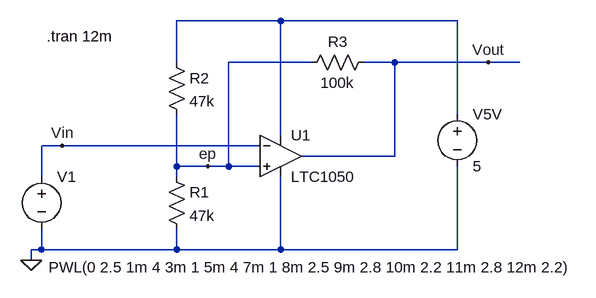
[diagram p0: schematic schmitt_5V.asc]
schmitt_5V.asc, the LTspice schematic file:
Version 4
SHEET 1 880 680
WIRE 224 -16 64 -16
WIRE 496 -16 224 -16
WIRE 64 48 64 -16
WIRE 272 48 144 48
WIRE 400 48 352 48
WIRE 544 48 400 48
WIRE 592 48 544 48
WIRE 496 128 496 -16
WIRE 224 160 224 -16
WIRE -112 176 -144 176
WIRE 192 176 -112 176
WIRE 400 192 400 48
WIRE 400 192 256 192
WIRE 64 208 64 128
WIRE 112 208 64 208
WIRE 144 208 144 48
WIRE 144 208 112 208
WIRE 192 208 144 208
WIRE -144 224 -144 176
WIRE 64 224 64 208
WIRE -144 336 -144 304
WIRE -144 336 -160 336
WIRE 64 336 64 304
WIRE 64 336 -144 336
WIRE 224 336 224 224
WIRE 224 336 64 336
WIRE 496 336 496 208
WIRE 496 336 224 336
WIRE -160 352 -160 336
FLAG 544 48 Vout
FLAG 112 208 ep
FLAG -112 176 Vin
FLAG -160 352 0
SYMBOL Opamps\\LTC1050 224 128 R0
SYMATTR InstName U1
SYMBOL res 368 32 R90
WINDOW 0 0 56 VBottom 2
WINDOW 3 32 56 VTop 2
SYMATTR InstName R3
SYMATTR Value 100k
SYMBOL voltage 496 112 R0
SYMATTR InstName V5V
SYMATTR Value 5
SYMBOL voltage -144 208 R0
WINDOW 123 0 0 Left 2
WINDOW 39 0 0 Left 2
WINDOW 3 11 155 Left 2
SYMATTR Value PWL(0 2.5 1m 4 3m 1 5m 4 7m 1 8m 2.5 9m 2.8 10m 2.2 11m 2.8 12m 2.2)
SYMATTR InstName V1
SYMBOL res 48 208 R0
SYMATTR InstName R1
SYMATTR Value 47k
SYMBOL res 48 32 R0
SYMATTR InstName R2
SYMATTR Value 47k
TEXT -136 8 Left 2 !.tran 12m

The netlist it stands for:
* schmitt_5V.asc
XU1 ep Vin N001 0 Vout LTC1050  ; pins In+ In- V+ V- OUT
R3 Vout ep 100k
V5V N001 0 5
V1 Vin 0 PWL(0 2.5 1m 4 3m 1 5m 4 7m 1 8m 2.5 9m 2.8 10m 2.2 11m 2.8 12m 2.2)
R1 ep 0 47k
R2 N001 ep 47k
.tran 12m
.lib LTC.lib
.backanno
.end